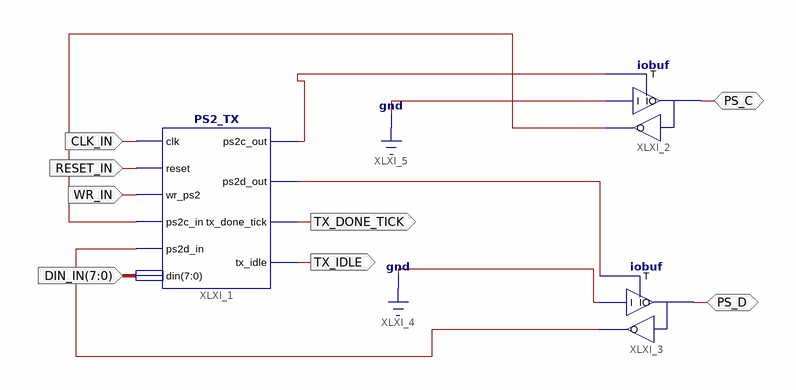
[diagram p0: schematic sheet 1]
// Xilinx ISE schematic schemat.sch (spartan3a) as structural Verilog: 3 symbols, 8 ports
module schemat (
  input  CLK_IN,
  input  RESET_IN,
  input  WR_IN,
  input  [7:0] DIN_IN,
  inout  PS_C,
  inout  PS_D,
  output TX_DONE_TICK,
  output TX_IDLE
);

  wire XLXN_12, XLXN_13, XLXN_14, XLXN_16;

  PS2_TX XLXI_1 (
    .clk(CLK_IN), .reset(RESET_IN), .wr_ps2(WR_IN), .ps2c_in(XLXN_14), .ps2d_in(XLXN_16), .din(DIN_IN),
    .ps2c_out(XLXN_12), .ps2d_out(XLXN_13), .tx_done_tick(TX_DONE_TICK), .tx_idle(TX_IDLE));
  iobuf XLXI_2 (.I(1'b0), .IO(PS_C), .O(XLXN_14), .T(XLXN_12));
  iobuf XLXI_3 (.I(1'b0), .IO(PS_D), .O(XLXN_16), .T(XLXN_13));
endmodule
